# Altium schematic sheet 0-OverView.SCHDOC
size A4
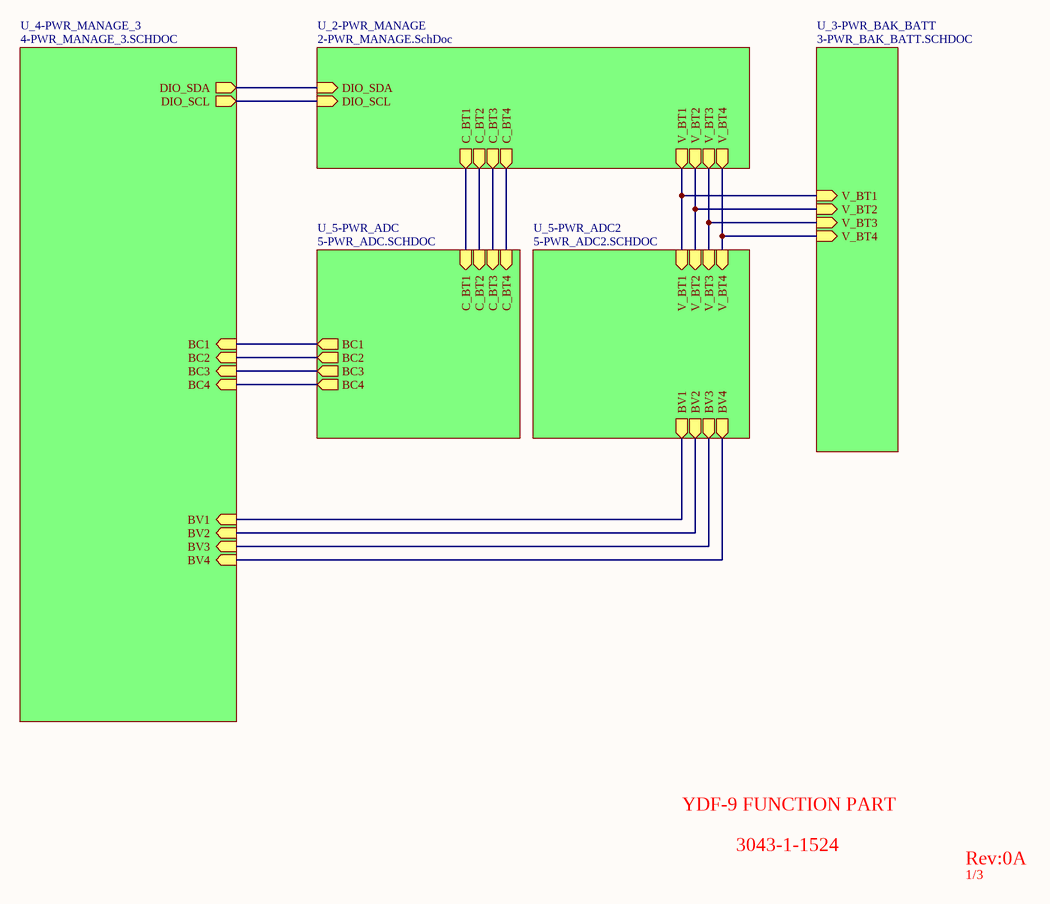
[diagram p0: 0-OverView.SCHDOC]

## Sub-sheets
U_2-PWR_MANAGE = 2-PWR_MANAGE.SchDoc: V_BT1 (out), V_BT2 (out), V_BT3 (out), V_BT4 (out), C_BT1 (out), C_BT2 (out), C_BT3 (out), C_BT4 (out), DIO_SDA (in), DIO_SCL (in)
U_3-PWR_BAK_BATT = 3-PWR_BAK_BATT.SCHDOC: V_BT2 (in), V_BT4 (in), V_BT1 (in), V_BT3 (in)
U_4-PWR_MANAGE_3 = 4-PWR_MANAGE_3.SCHDOC: DIO_SDA (out), DIO_SCL (out), BC1 (in), BV2 (in), BV1 (in), BV3 (in), BC4 (in), BV4 (in), BC2 (in), BC3 (in)
U_5-PWR_ADC = 5-PWR_ADC.SCHDOC: C_BT1 (in), C_BT2 (in), C_BT3 (in), C_BT4 (in), BC1 (out), BC2 (out), BC3 (out), BC4 (out)
U_5-PWR_ADC2 = 5-PWR_ADC2.SCHDOC: V_BT1 (in), V_BT2 (in), V_BT3 (in), V_BT4 (in), BV2 (out), BV3 (out), BV4 (out), BV1 (out)

## Nets
(unnamed): sheet U_2-PWR_MANAGE/V_BT1, sheet U_3-PWR_BAK_BATT/V_BT1, sheet U_5-PWR_ADC2/V_BT1
(unnamed): sheet U_2-PWR_MANAGE/V_BT2, sheet U_3-PWR_BAK_BATT/V_BT2, sheet U_5-PWR_ADC2/V_BT2
(unnamed): sheet U_2-PWR_MANAGE/V_BT3, sheet U_3-PWR_BAK_BATT/V_BT3, sheet U_5-PWR_ADC2/V_BT3
(unnamed): sheet U_2-PWR_MANAGE/V_BT4, sheet U_3-PWR_BAK_BATT/V_BT4, sheet U_5-PWR_ADC2/V_BT4
(unnamed): sheet U_2-PWR_MANAGE/C_BT1, sheet U_5-PWR_ADC/C_BT1
(unnamed): sheet U_2-PWR_MANAGE/C_BT2, sheet U_5-PWR_ADC/C_BT2
(unnamed): sheet U_2-PWR_MANAGE/C_BT3, sheet U_5-PWR_ADC/C_BT3
(unnamed): sheet U_2-PWR_MANAGE/C_BT4, sheet U_5-PWR_ADC/C_BT4
(unnamed): sheet U_2-PWR_MANAGE/DIO_SDA, sheet U_4-PWR_MANAGE_3/DIO_SDA
(unnamed): sheet U_2-PWR_MANAGE/DIO_SCL, sheet U_4-PWR_MANAGE_3/DIO_SCL
(unnamed): sheet U_4-PWR_MANAGE_3/BC1, sheet U_5-PWR_ADC/BC1
(unnamed): sheet U_4-PWR_MANAGE_3/BV2, sheet U_5-PWR_ADC2/BV2
(unnamed): sheet U_4-PWR_MANAGE_3/BV1, sheet U_5-PWR_ADC2/BV1
(unnamed): sheet U_4-PWR_MANAGE_3/BV3, sheet U_5-PWR_ADC2/BV3
(unnamed): sheet U_4-PWR_MANAGE_3/BC4, sheet U_5-PWR_ADC/BC4
(unnamed): sheet U_4-PWR_MANAGE_3/BV4, sheet U_5-PWR_ADC2/BV4
(unnamed): sheet U_4-PWR_MANAGE_3/BC2, sheet U_5-PWR_ADC/BC2
(unnamed): sheet U_4-PWR_MANAGE_3/BC3, sheet U_5-PWR_ADC/BC3

## Notes on the sheet
- YDF-9 FUNCTION PART
- 3043-1-1524
- Rev:0A
- 1/3